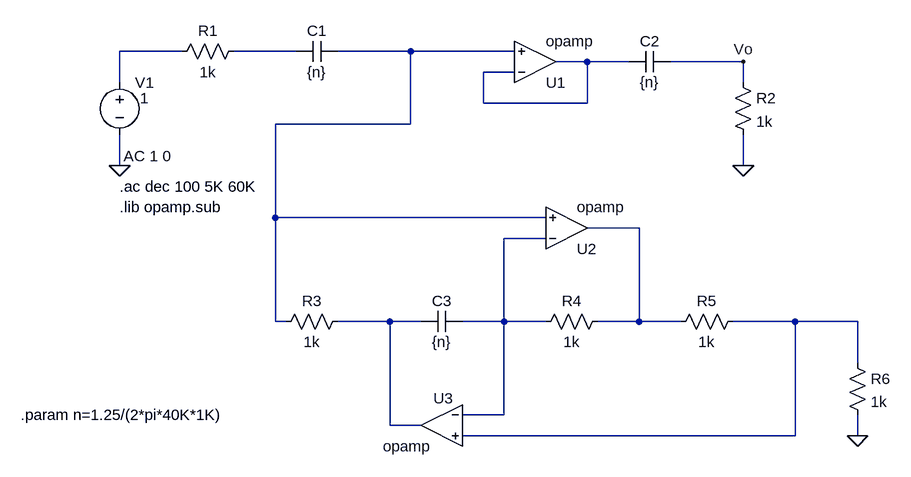
[diagram p0: schematic TS4_Punto4.asc]
TS4_Punto4.asc, the LTspice schematic file:
Version 4
SHEET 1 1320 780
WIRE 16 144 -80 144
WIRE 192 144 96 144
WIRE 368 144 256 144
WIRE 528 144 368 144
WIRE 640 160 592 160
WIRE 704 160 640 160
WIRE 880 160 768 160
WIRE 528 176 480 176
WIRE -80 192 -80 144
WIRE 880 192 880 160
WIRE 480 224 480 176
WIRE 640 224 640 160
WIRE 640 224 480 224
WIRE 368 256 368 144
WIRE 368 256 160 256
WIRE -80 320 -80 272
WIRE 880 320 880 272
WIRE 160 400 160 256
WIRE 576 400 160 400
WIRE 720 416 640 416
WIRE 576 432 512 432
WIRE 160 560 160 400
WIRE 176 560 160 560
WIRE 336 560 256 560
WIRE 384 560 336 560
WIRE 512 560 512 432
WIRE 512 560 448 560
WIRE 576 560 512 560
WIRE 720 560 720 416
WIRE 720 560 656 560
WIRE 784 560 720 560
WIRE 960 560 864 560
WIRE 1056 560 960 560
WIRE 1056 624 1056 560
WIRE 512 704 512 560
WIRE 512 704 448 704
WIRE 336 720 336 560
WIRE 384 720 336 720
WIRE 960 736 960 560
WIRE 960 736 448 736
WIRE 1056 736 1056 704
FLAG -80 320 0
FLAG 880 160 Vo
FLAG 880 320 0
FLAG 1056 736 0
SYMBOL res 112 128 R90
WINDOW 0 0 56 VBottom 2
WINDOW 3 32 56 VTop 2
SYMATTR InstName R1
SYMATTR Value 1k
SYMBOL cap 256 128 R90
WINDOW 0 0 32 VBottom 2
WINDOW 3 32 32 VTop 2
SYMATTR InstName C1
SYMATTR Value {n}
SYMBOL OpAmps\\opamp 560 224 M180
SYMATTR InstName U1
SYMBOL res 864 176 R0
SYMATTR InstName R2
SYMATTR Value 1k
SYMBOL cap 768 144 R90
WINDOW 0 0 32 VBottom 2
WINDOW 3 32 32 VTop 2
SYMATTR InstName C2
SYMATTR Value {n}
SYMBOL voltage -80 176 R0
WINDOW 3 32 40 Left 2
WINDOW 123 6 129 Left 2
WINDOW 39 0 0 Left 0
SYMATTR Value 1
SYMATTR Value2 AC 1 0
SYMATTR InstName V1
SYMBOL OpAmps\\opamp 608 480 M180
SYMATTR InstName U2
SYMBOL res 272 544 R90
WINDOW 0 0 56 VBottom 2
WINDOW 3 32 56 VTop 2
SYMATTR InstName R3
SYMATTR Value 1k
SYMBOL cap 448 544 R90
WINDOW 0 0 32 VBottom 2
WINDOW 3 32 32 VTop 2
SYMATTR InstName C3
SYMATTR Value {n}
SYMBOL res 672 544 R90
WINDOW 0 0 56 VBottom 2
WINDOW 3 32 56 VTop 2
SYMATTR InstName R4
SYMATTR Value 1k
SYMBOL res 880 544 R90
WINDOW 0 0 56 VBottom 2
WINDOW 3 32 56 VTop 2
SYMATTR InstName R5
SYMATTR Value 1k
SYMBOL OpAmps\\opamp 416 656 M0
WINDOW 0 -18 22 Left 2
SYMATTR InstName U3
SYMBOL res 1040 608 R0
SYMATTR InstName R6
SYMATTR Value 1k
TEXT -80 384 Left 2 !.lib opamp.sub
TEXT -80 352 Left 2 !.ac dec 100 5K 60K
TEXT -232 704 Left 2 !.param n=1.25/(2*pi*40K*1K)

The netlist it stands for:
* TS4_Punto4.asc
R1 N002 N001 1k
C1 N003 N002 {n}
XU1 N004 N003 N004 opamp Aol=100K GBW=10Meg  ; pins invin noninvin out
R2 Vo 0 1k
C2 Vo N004 {n}
V1 N001 0 1 AC 1 0
XU2 N006 N003 N005 opamp Aol=100K GBW=10Meg  ; pins invin noninvin out
R3 N007 N003 1k
C3 N006 N007 {n}
R4 N005 N006 1k
R5 N008 N005 1k
XU3 N006 N008 N007 opamp Aol=100K GBW=10Meg  ; pins invin noninvin out
R6 N008 0 1k
.lib opamp.sub
.ac dec 100 5K 60K
.param n=1.25/(2*pi*40K*1K)
.backanno
.end